# Altium schematic sheet IO_PWR_FMU_REV_2A.SchDoc: Cube Yellow and Cube Orange
size A3; Date: 18/08/2014 1:53:31 PM; Author: PR; DrawnBy: Philip Rowse; Engineer: Philip Rowse; Organization: ProfiCNC/Hex; Address3: VIC; Address4: Australia; Revision: A; SheetNumber: 10; SheetTotal: 10
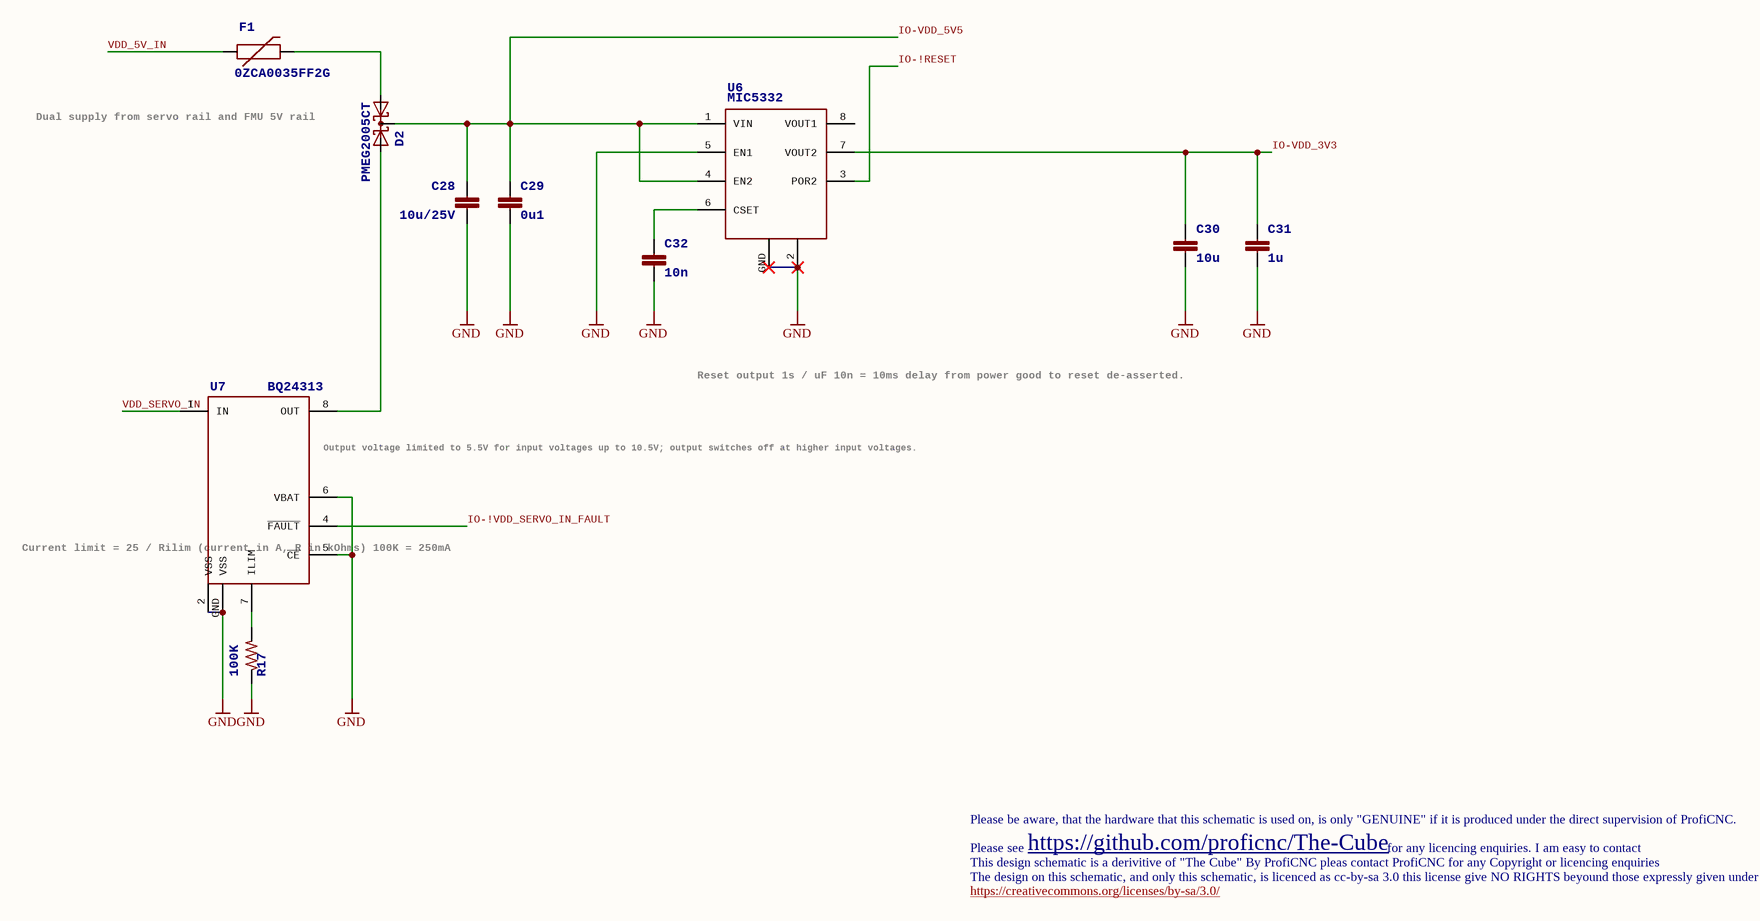
[diagram p0: IO_PWR_FMU_REV_2A.SchDoc]

## Parts
C28  10u/25V  [0805-CAP]
C29  0u1  [0402-CAP]
C30  10u  [0603-CAP]
C31  1u  [0603-CAP]
C32  10n  [0402-CAP]
D2  PMEG2005CT  [SOT23-3]
F1  0ZCA0035FF2G  [PTC-1206]
Logo1  ProfiCNC_LOGO  [ProfiCNC_medium]  (value not drawn)  (no BOM)
R17  100K  [0402-RES]
U6  MIC5332  [MLF-8-EPAD]
U7  BQ24313  [QFN8-DSG]

## Nets
GND: C28.P$2 C29.P$2 C30.P$2 C31.P$2 C32.P$2 R17.P$1 U6.2(GND) U6.5(EN1) U6.GND U7.2(VSS) U7.5(~{CE}) U7.6(VBAT) U7.GND(VSS)
IO-!RESET: U6.3(POR2)
IO-!VDD_SERVO_IN_FAULT: U7.4(~{FAULT})
IO-VDD_3V3: C30.P$1 C31.P$1 U6.7(VOUT2)
IO-VDD_5V5: C28.P$1 C29.P$1 D2.3(CC) U6.1(VIN) U6.4(EN2)
VDD_5V_IN: F1.1
VDD_SERVO_IN: U7.1(IN)
NetC32_P$1: C32.P$1 U6.6(CSET)
NetD2_1: D2.1(A1) F1.2
NetD2_2: D2.2(A2) U7.8(OUT)
NetR17_P$2: R17.P$2 U7.7(ILIM)

Not connected (* = marked no-connect by the designer): U6 8(VOUT1)

## Notes on the sheet
- Dual supply from
  servo rail and FMU 5V rail
- Reset output 1s / uF
  10n = 10ms delay from power good
  to reset de-asserted.
- (near U7) Output voltage limited to 5.5V for
  input voltages up to 10.5V; output
  switches off at higher input voltages.
- (near U7) Current limit = 25 / Rilim
  (current in A, R in kOhms)
  100K = 250mA
- Please be aware, that the hardware that this schematic is used on, is only "GENUINE" if it is produced under the direct supervision of ProfiCNC.
- The design on this schematic, and only this schematic, is licenced as cc-by-sa 3.0 this license give NO RIGHTS beyound those expressly given under the terms of this license.
- This design schematic is a derivitive of "The Cube" By ProfiCNC pleas contact ProfiCNC for any Copyright or licencing enquiries
- https://creativecommons.org/licenses/by-sa/3.0/
- Please see
- https://github.com/proficnc/The-Cube
- for any licencing enquiries. I am easy to contact
- Drawn By:
- Verified for production by:
- Approved for release:
- Title
- Size:
- Date:
- A
- Number:
- Time:
- Revision:
- Sheet
- of
- File:

## Library data of the parts
C28 = CAP0805: CAP CER 10UF 25V 10% X5R 0805; Value: 10u/25
C29 = CAP0402: CAP CER 0.1UF 16V Y5V 0402; Value: 0u1
C30 = CAP0603: CAP CER 10UF 10V 10% X5R 0603; Value: 10u
C31 = CAP0603: CAP CER 1UF 16V Y5V 0603; Value: 1u
C32 = CAP0402: CAP CER 10000PF 16V 10% X7R 0402; Value: 10n
D2 = PMEG2005CT: DIODE SCHOTTKY 20V 500MA TO236AB; Value: 20V
F1 = PTCSMD: PTC RESTTBLE 0.35A 16V CHIP 1206; Value: 0.35A
R17 = RESISTOR0402-RES: RES 100K OHM 1/16W 1% 0402 SMD; Value: 100K
U6 = MIC5332: IC REG LDO 3.3V 0.3A 8TMLF; Value: 3.3V
U7 = BQ24313: IC LI+ CHARGER FRONT END 8-SON